# EAGLE schematic silense_analog_question (EAGLE 9.4.2)

## Sheet 1 of 6
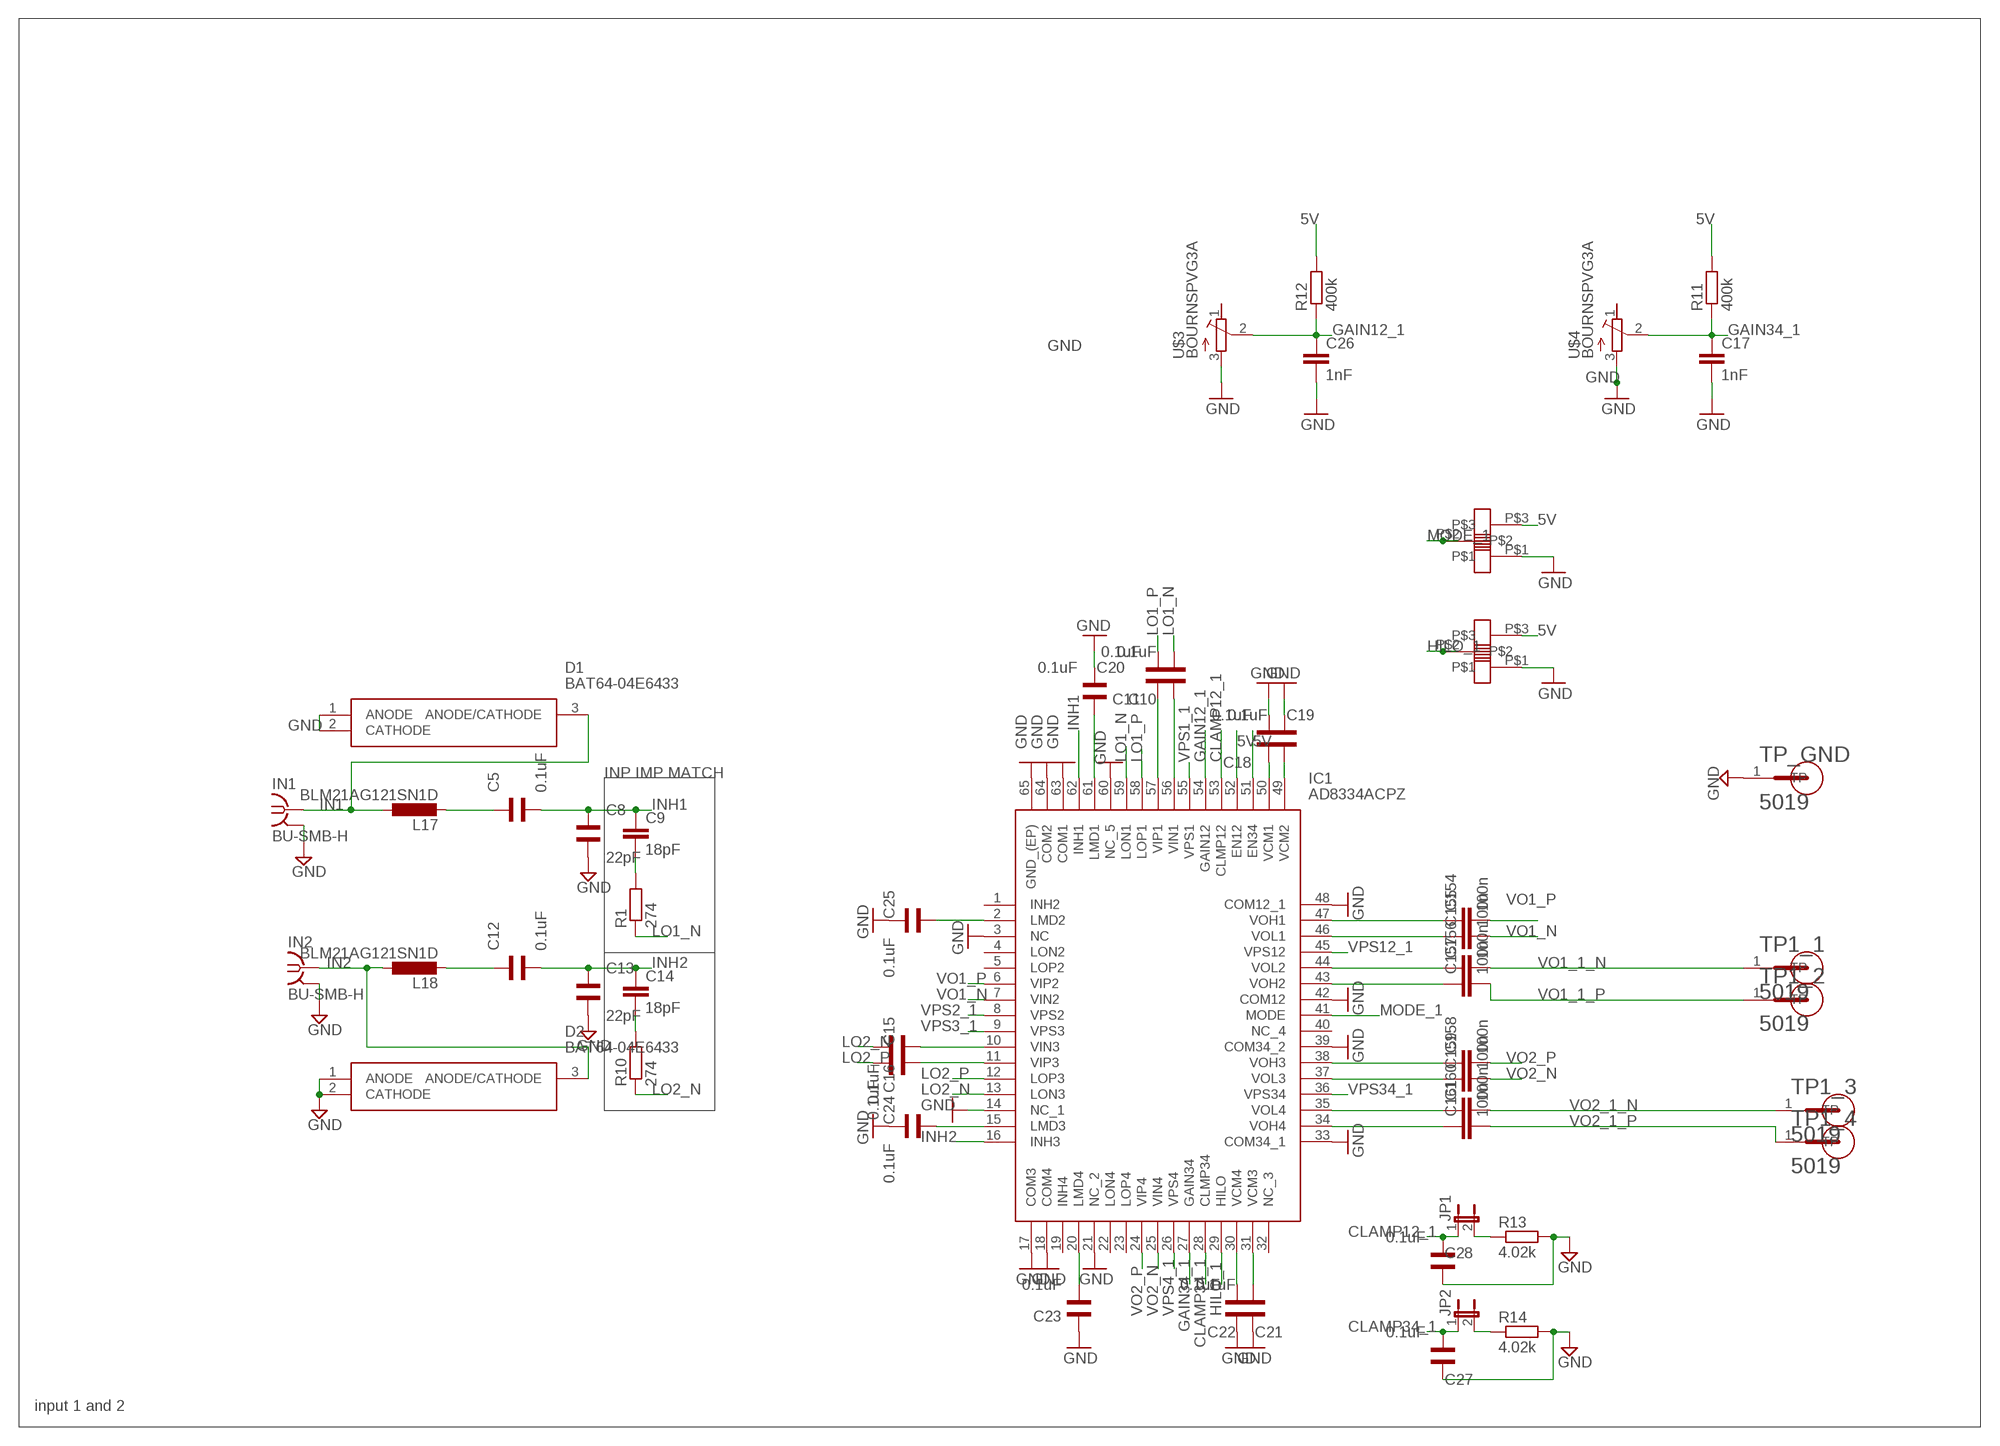
[diagram p0: schematic, sheet 1]

### Parts
C5  0.1uF  WCAP-CSGP_0402_885012205037  [WCAP-CSGP_0402]
C8  22pF  WCAP-CSGP_0402_885012005009  [WCAP-CSGP_0402]
C9  18pF  C-EUC0603  [C0603]
C10  0.1uF  WCAP-CSGP_0402_885012205037  [WCAP-CSGP_0402]
C11  0.1uF  WCAP-CSGP_0402_885012205037  [WCAP-CSGP_0402]
C12  0.1uF  WCAP-CSGP_0402_885012205037  [WCAP-CSGP_0402]
C13  22pF  WCAP-CSGP_0402_885012005009  [WCAP-CSGP_0402]
C14  18pF  C-EUC0603  [C0603]
C15  0.1uF  WCAP-CSGP_0402_885012205037  [WCAP-CSGP_0402]
C16  0.1uF  WCAP-CSGP_0402_885012205037  [WCAP-CSGP_0402]
C17  1nF  C-EUC0402  [C0402]
C18  0.1uF  WCAP-CSGP_0402_885012205037  [WCAP-CSGP_0402]
C19  0.1uF  WCAP-CSGP_0402_885012205037  [WCAP-CSGP_0402]
C20  0.1uF  WCAP-CSGP_0402_885012205037  [WCAP-CSGP_0402]
C21  0.1uF  WCAP-CSGP_0402_885012205037  [WCAP-CSGP_0402]
C22  0.1uF  WCAP-CSGP_0402_885012205037  [WCAP-CSGP_0402]
C23  0.1uF  WCAP-CSGP_0402_885012205037  [WCAP-CSGP_0402]
C24  0.1uF  WCAP-CSGP_0402_885012205037  [WCAP-CSGP_0402]
C25  0.1uF  WCAP-CSGP_0402_885012205037  [WCAP-CSGP_0402]
C26  1nF  C-EUC0402  [C0402]
C27  0.1uF  WCAP-CSGP_0402_885012205037  [WCAP-CSGP_0402]
C28  0.1uF  WCAP-CSGP_0402_885012205037  [WCAP-CSGP_0402]
C154  100n  C-EUC0805  [C0805]
C155  100n  C-EUC0805  [C0805]
C156  100n  C-EUC0805  [C0805]
C157  100n  C-EUC0805  [C0805]
C158  100n  C-EUC0805  [C0805]
C159  100n  C-EUC0805  [C0805]
C160  100n  C-EUC0805  [C0805]
C161  100n  C-EUC0805  [C0805]
D1  BAT64-04E6433  [SOT95P260X110-3N]
D2  BAT64-04E6433  [SOT95P260X110-3N]
IC1  AD8334ACPZ  [QFN50P900X900X100-65N]
IN1  BU-SMB-H  [BU-SMB-H]
IN2  BU-SMB-H  [BU-SMB-H]
JP1  JP1E  [JP1]
JP2  JP1E  [JP1]
L17  BLM21AG121SN1D  L-EUL2012C  [L2012C]
L18  BLM21AG121SN1D  L-EUL2012C  [L2012C]
R1  274  R-EU_R0603  [R0603]
R10  274  R-EU_R0603  [R0603]
R11  400k  R-EU_R0603  [R0603]
R12  400k  R-EU_R0603  [R0603]
R13  4.02k  R-EU_R0805  [R0805]
R14  4.02k  R-EU_R0805  [R0805]
SLIDESWITCH1  CL-SB-12A-01  [CL-SB-12A-01]
SLIDESWITCH2  CL-SB-12A-01  [CL-SB-12A-01]
TP1_1  5019  [TP380X203]
TP1_2  5019  [TP380X203]
TP1_3  5019  [TP380X203]
TP1_4  5019  [TP380X203]
TP_GND  5019  [TP380X203]
U$3  BOURNSPVG3A  [PVG3G]
U$4  BOURNSPVG3A  [PVG3G]

### Nets
5V [power]: IC1.51(EN34) IC1.52(EN12) R11.2 R12.2 SLIDESWITCH1.P$3 SLIDESWITCH2.P$3 ; also sheet 2,3,4,6
CLAMP12_1: C28.1 IC1.53(CLMP12) JP1.1
CLAMP34_1: C27.1 IC1.28(CLMP34) JP2.1
GAIN12_1: C26.1 IC1.54(GAIN12) R12.1 U$3.2
GAIN34_1: C17.1 IC1.27(GAIN34) R11.1 U$4.2
GND [power]: C8.1 C13.1 C17.2 C18.1 C19.1 C20.1 C21.2 C22.2 C23.2 C24.1 C25.1 C26.2 C27.2 C28.2 D1.1(ANODE) D1.2(CATHODE) D2.1(ANODE) D2.2(CATHODE) IC1.3(NC) IC1.14(NC_1) IC1.17(COM3) IC1.18(COM4) IC1.21(NC_2) IC1.33(COM34_1) IC1.39(COM34_2) IC1.42(COM12) IC1.48(COM12_1) IC1.60(NC_5) IC1.63(COM1) IC1.64(COM2) IC1.65(GND_(EP)) IN1.2 IN1.3 IN1.4 IN1.5 IN2.2 IN2.3 IN2.4 IN2.5 R13.2 R14.2 SLIDESWITCH1.P$1 SLIDESWITCH2.P$1 TP_GND.1(TP) U$3.3 U$4.3 ; also sheet 2,3,4,5,6
HILO_1: IC1.29(HILO) SLIDESWITCH2.P$2
IN1: D1.3(ANODE/CATHODE) IN1.1 L17.1
IN2: D2.3(ANODE/CATHODE) IN2.1 L18.1
INH1: C5.1 C8.2 C9.1 IC1.62(INH1)
INH2: C12.1 C13.2 C14.1 IC1.16(INH3)
LO1_N [differential]: C10.1 IC1.59(LON1) R1.1
LO1_P [differential]: C11.1 IC1.58(LOP1)
LO2_N [differential]: C15.1 IC1.13(LON3) R10.1
LO2_P [differential]: C16.1 IC1.12(LOP3)
MODE_1: IC1.41(MODE) SLIDESWITCH1.P$2
N$1: C5.2 L17.2
N$2: C9.2 R1.2
N$4_N: C10.2 IC1.56(VIN1)
N$4_P [differential]: C11.2 IC1.57(VIP1)
N$5: C154.1 IC1.47(VOH1)
N$6: C155.1 IC1.46(VOL1)
N$7: C156.1 IC1.44(VOL2)
N$8: C157.1 IC1.43(VOH2)
N$9: C158.1 IC1.38(VOH3)
N$10: C159.1 IC1.37(VOL3)
N$11: C160.1 IC1.35(VOL4)
N$12: C161.1 IC1.34(VOH4)
N$13: C12.2 L18.2
N$14: C14.2 R10.2
N$15_N: C15.2 IC1.10(VIN3)
N$15_P [differential]: C16.2 IC1.11(VIP3)
N$17: C18.2 IC1.50(VCM1)
N$18: C19.2 IC1.49(VCM2)
N$19: C20.2 IC1.61(LMD1)
N$20: C22.1 IC1.30(VCM4)
N$21: C21.1 IC1.31(VCM3)
N$22: C25.2 IC1.2(LMD2)
N$25: C24.2 IC1.15(LMD3)
N$26: C23.1 IC1.20(LMD4)
N$27: JP1.2 R13.1
N$28: JP2.2 R14.1
VO1_1_N [differential]: C156.2 TP1_1.1(TP) ; also sheet 4
VO1_1_P [differential]: C157.2 TP1_2.1(TP) ; also sheet 4
VO1_N: C155.2 IC1.7(VIN2)
VO1_P [differential]: C154.2 IC1.6(VIP2)
VO2_1_N [differential]: C160.2 TP1_3.1(TP) ; also sheet 4
VO2_1_P [differential]: C161.2 TP1_4.1(TP) ; also sheet 4
VO2_N: C159.2 IC1.25(VIN4)
VO2_P [differential]: C158.2 IC1.24(VIP4)
VPS1_1: IC1.55(VPS1) ; also sheet 2
VPS2_1: IC1.8(VPS2) ; also sheet 2
VPS3_1: IC1.9(VPS3) ; also sheet 2
VPS4_1: IC1.26(VPS4) ; also sheet 2
VPS12_1: IC1.45(VPS12) ; also sheet 2
VPS34_1: IC1.36(VPS34) ; also sheet 2
Unconnected: IC1.1(INH2) IC1.4(LON2) IC1.5(LOP2) IC1.19(INH4) IC1.22(LON4) IC1.23(LOP4) IC1.32(NC_3) IC1.40(NC_4) U$3.1 U$4.1

### Notes on the sheet
- INP IMP MATCH
- input 1 and 2

## Sheet 2 of 6
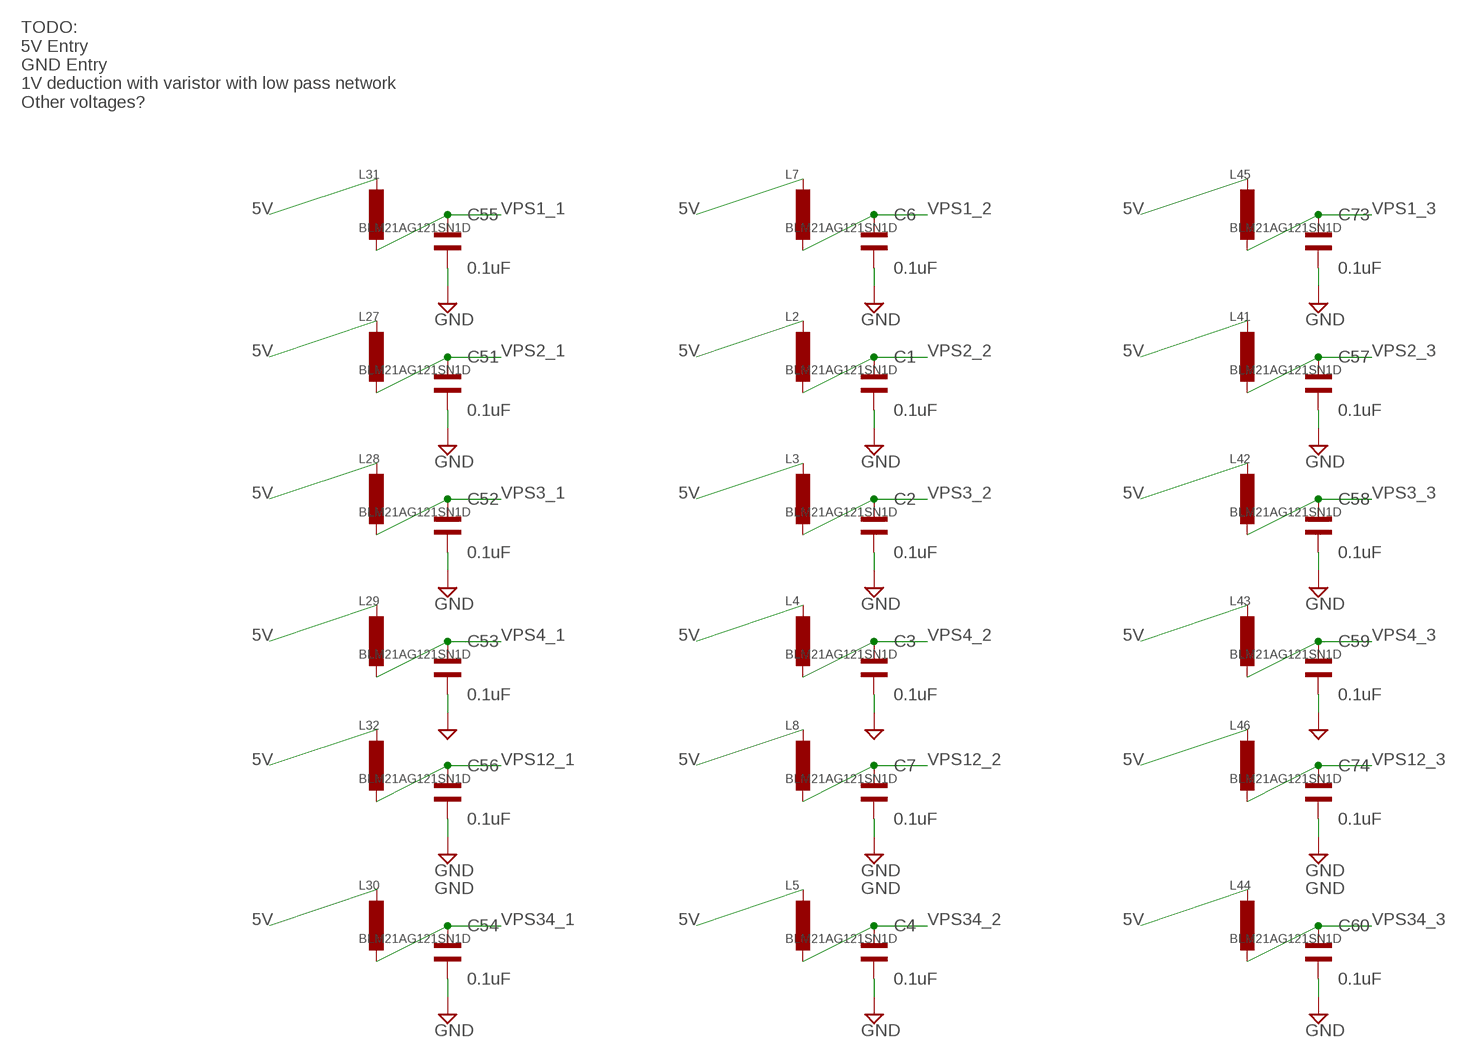
[diagram p1: schematic, sheet 2]

### Parts
C1  0.1uF  WCAP-CSGP_0402_885012205037  [WCAP-CSGP_0402]
C2  0.1uF  WCAP-CSGP_0402_885012205037  [WCAP-CSGP_0402]
C3  0.1uF  WCAP-CSGP_0402_885012205037  [WCAP-CSGP_0402]
C4  0.1uF  WCAP-CSGP_0402_885012205037  [WCAP-CSGP_0402]
C6  0.1uF  WCAP-CSGP_0402_885012205037  [WCAP-CSGP_0402]
C7  0.1uF  WCAP-CSGP_0402_885012205037  [WCAP-CSGP_0402]
C51  0.1uF  WCAP-CSGP_0402_885012205037  [WCAP-CSGP_0402]
C52  0.1uF  WCAP-CSGP_0402_885012205037  [WCAP-CSGP_0402]
C53  0.1uF  WCAP-CSGP_0402_885012205037  [WCAP-CSGP_0402]
C54  0.1uF  WCAP-CSGP_0402_885012205037  [WCAP-CSGP_0402]
C55  0.1uF  WCAP-CSGP_0402_885012205037  [WCAP-CSGP_0402]
C56  0.1uF  WCAP-CSGP_0402_885012205037  [WCAP-CSGP_0402]
C57  0.1uF  WCAP-CSGP_0402_885012205037  [WCAP-CSGP_0402]
C58  0.1uF  WCAP-CSGP_0402_885012205037  [WCAP-CSGP_0402]
C59  0.1uF  WCAP-CSGP_0402_885012205037  [WCAP-CSGP_0402]
C60  0.1uF  WCAP-CSGP_0402_885012205037  [WCAP-CSGP_0402]
C73  0.1uF  WCAP-CSGP_0402_885012205037  [WCAP-CSGP_0402]
C74  0.1uF  WCAP-CSGP_0402_885012205037  [WCAP-CSGP_0402]
L2  BLM21AG121SN1D  L-EUL2012C  [L2012C]
L3  BLM21AG121SN1D  L-EUL2012C  [L2012C]
L4  BLM21AG121SN1D  L-EUL2012C  [L2012C]
L5  BLM21AG121SN1D  L-EUL2012C  [L2012C]
L7  BLM21AG121SN1D  L-EUL2012C  [L2012C]
L8  BLM21AG121SN1D  L-EUL2012C  [L2012C]
L27  BLM21AG121SN1D  L-EUL2012C  [L2012C]
L28  BLM21AG121SN1D  L-EUL2012C  [L2012C]
L29  BLM21AG121SN1D  L-EUL2012C  [L2012C]
L30  BLM21AG121SN1D  L-EUL2012C  [L2012C]
L31  BLM21AG121SN1D  L-EUL2012C  [L2012C]
L32  BLM21AG121SN1D  L-EUL2012C  [L2012C]
L41  BLM21AG121SN1D  L-EUL2012C  [L2012C]
L42  BLM21AG121SN1D  L-EUL2012C  [L2012C]
L43  BLM21AG121SN1D  L-EUL2012C  [L2012C]
L44  BLM21AG121SN1D  L-EUL2012C  [L2012C]
L45  BLM21AG121SN1D  L-EUL2012C  [L2012C]
L46  BLM21AG121SN1D  L-EUL2012C  [L2012C]

### Nets
5V [power]: L2.1 L3.1 L4.1 L5.1 L7.1 L8.1 L27.1 L28.1 L29.1 L30.1 L31.1 L32.1 L41.1 L42.1 L43.1 L44.1 L45.1 L46.1 ; also sheet 1,3,4,6
GND [power]: C1.1 C2.1 C3.1 C4.1 C6.1 C7.1 C51.1 C52.1 C53.1 C54.1 C55.1 C56.1 C57.1 C58.1 C59.1 C60.1 C73.1 C74.1 ; also sheet 1,3,4,5,6
VPS1_1: C55.2 L31.2 ; also sheet 1
VPS1_2: C6.2 L7.2 ; also sheet 3
VPS1_3: C73.2 L45.2 ; also sheet 4
VPS2_1: C51.2 L27.2 ; also sheet 1
VPS2_2: C1.2 L2.2 ; also sheet 3
VPS2_3: C57.2 L41.2 ; also sheet 4
VPS3_1: C52.2 L28.2 ; also sheet 1
VPS3_2: C2.2 L3.2 ; also sheet 3
VPS3_3: C58.2 L42.2 ; also sheet 4
VPS4_1: C53.2 L29.2 ; also sheet 1
VPS4_2: C3.2 L4.2 ; also sheet 3
VPS4_3: C59.2 L43.2 ; also sheet 4
VPS12_1: C56.2 L32.2 ; also sheet 1
VPS12_2: C7.2 L8.2 ; also sheet 3
VPS12_3: C74.2 L46.2 ; also sheet 4
VPS34_1: C54.2 L30.2 ; also sheet 1
VPS34_2: C4.2 L5.2 ; also sheet 3
VPS34_3: C60.2 L44.2 ; also sheet 4

### Notes on the sheet
- TODO:
  5V Entry
  GND Entry
  1V deduction with varistor with low pass network
  Other voltages?

## Sheet 3 of 6
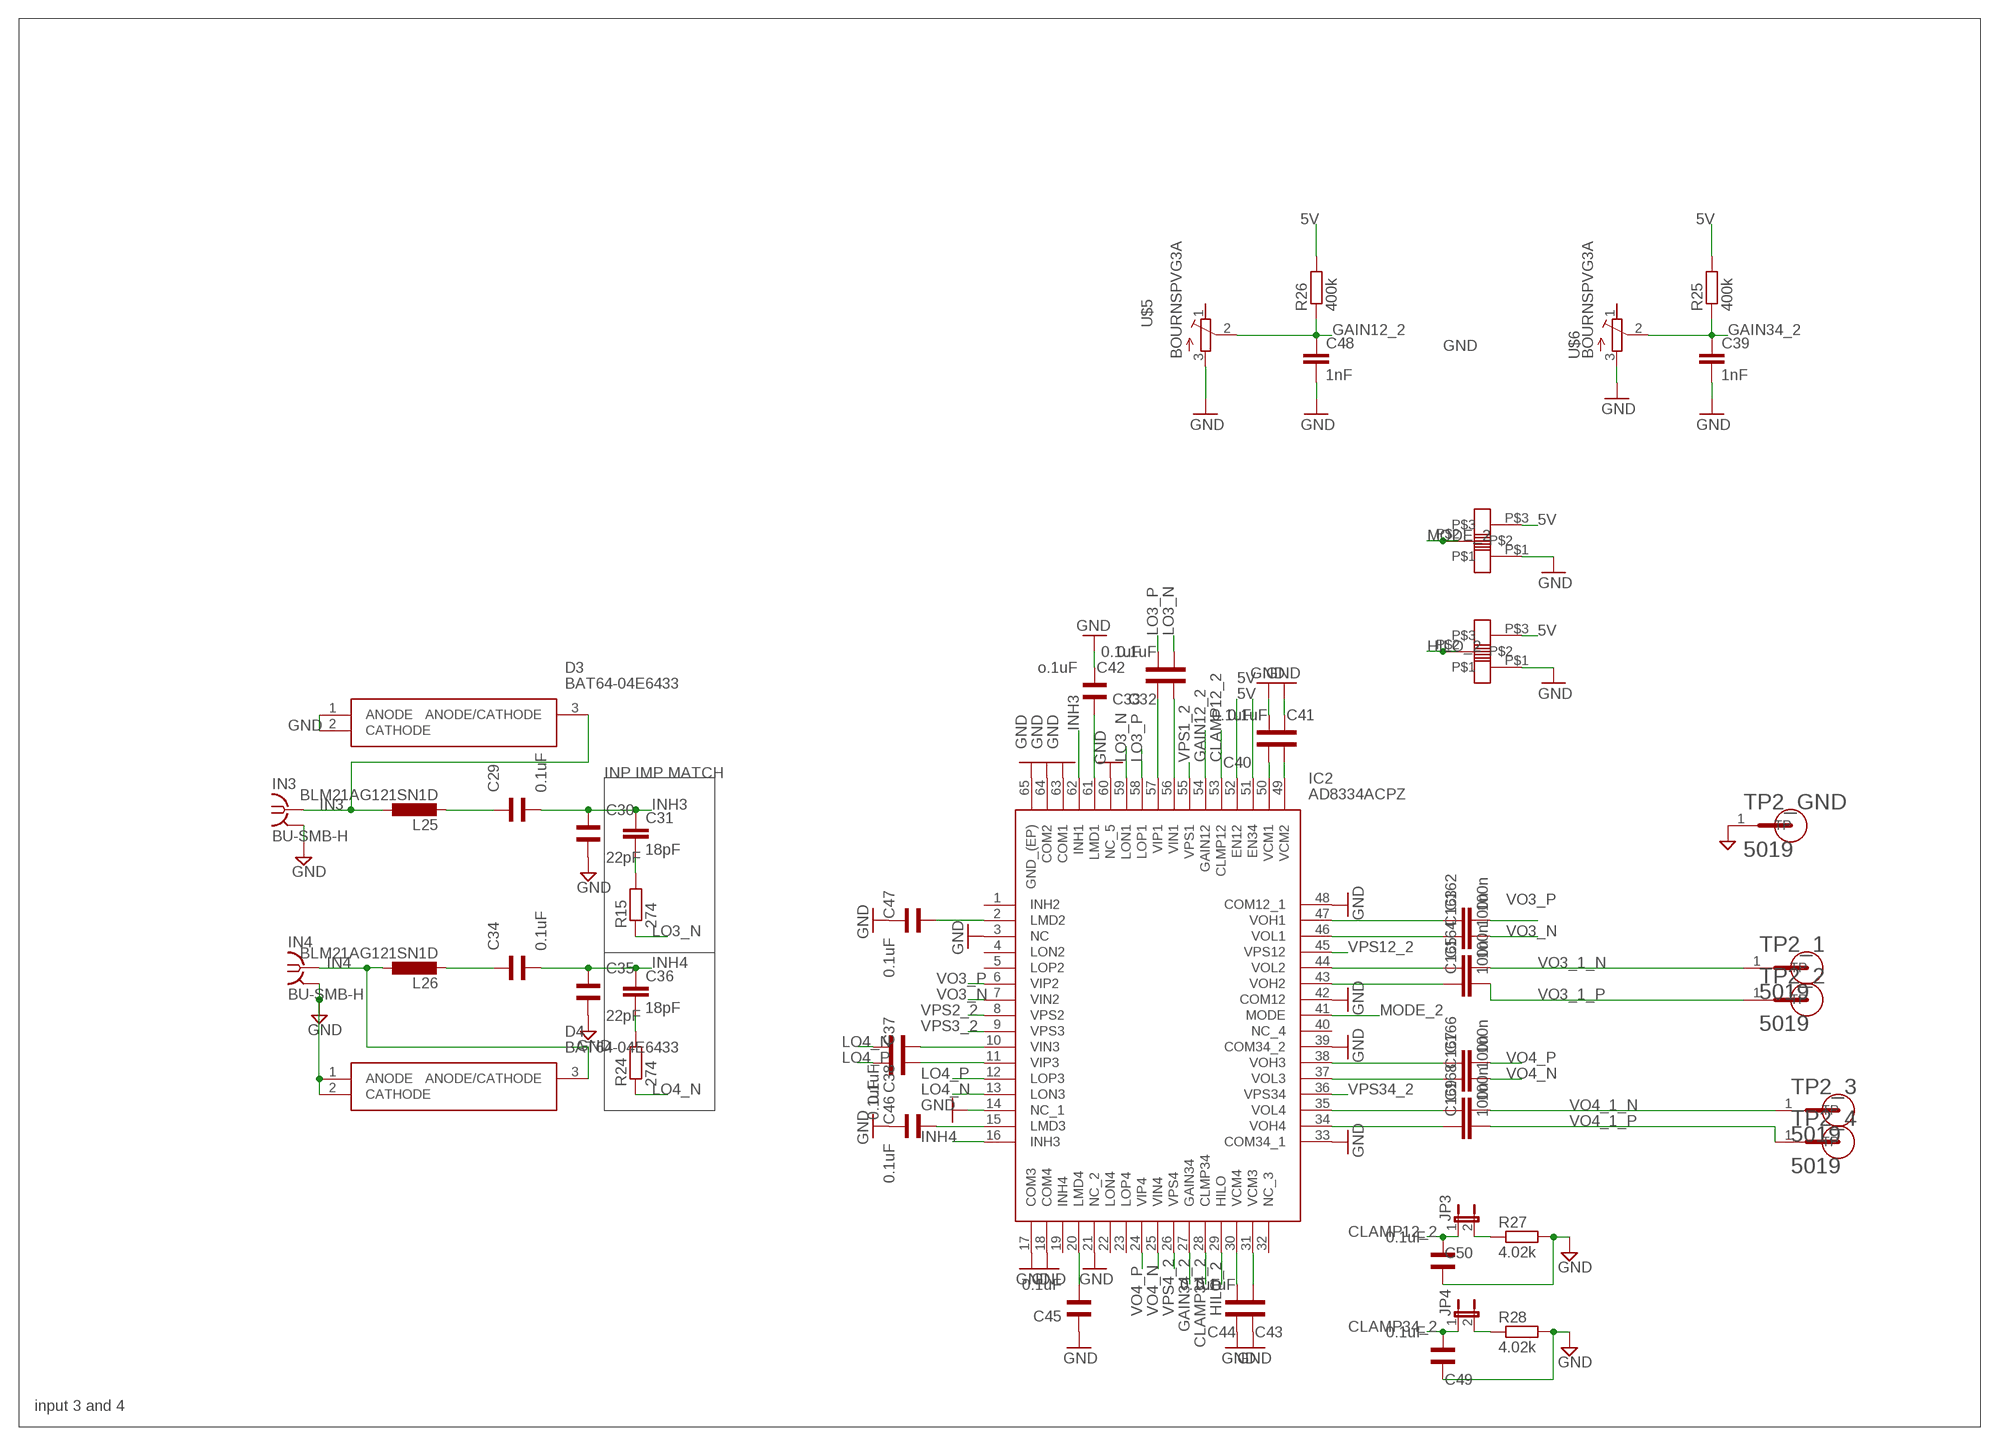
[diagram p2: schematic, sheet 3]

### Parts
C29  0.1uF  WCAP-CSGP_0402_885012205037  [WCAP-CSGP_0402]
C30  22pF  WCAP-CSGP_0402_885012005009  [WCAP-CSGP_0402]
C31  18pF  C-EUC0603  [C0603]
C32  0.1uF  WCAP-CSGP_0402_885012205037  [WCAP-CSGP_0402]
C33  0.1uF  WCAP-CSGP_0402_885012205037  [WCAP-CSGP_0402]
C34  0.1uF  WCAP-CSGP_0402_885012205037  [WCAP-CSGP_0402]
C35  22pF  WCAP-CSGP_0402_885012005009  [WCAP-CSGP_0402]
C36  18pF  C-EUC0603  [C0603]
C37  0.1uF  WCAP-CSGP_0402_885012205037  [WCAP-CSGP_0402]
C38  0.1uF  WCAP-CSGP_0402_885012205037  [WCAP-CSGP_0402]
C39  1nF  C-EUC0402  [C0402]
C40  0.1uF  WCAP-CSGP_0402_885012205037  [WCAP-CSGP_0402]
C41  0.1uF  WCAP-CSGP_0402_885012205037  [WCAP-CSGP_0402]
C42  o.1uF  WCAP-CSGP_0402_885012205037  [WCAP-CSGP_0402]
C43  0.1uF  WCAP-CSGP_0402_885012205037  [WCAP-CSGP_0402]
C44  0.1uF  WCAP-CSGP_0402_885012205037  [WCAP-CSGP_0402]
C45  0.1uF  WCAP-CSGP_0402_885012205037  [WCAP-CSGP_0402]
C46  0.1uF  WCAP-CSGP_0402_885012205037  [WCAP-CSGP_0402]
C47  0.1uF  WCAP-CSGP_0402_885012205037  [WCAP-CSGP_0402]
C48  1nF  C-EUC0402  [C0402]
C49  0.1uF  WCAP-CSGP_0402_885012205037  [WCAP-CSGP_0402]
C50  0.1uF  WCAP-CSGP_0402_885012205037  [WCAP-CSGP_0402]
C162  100n  C-EUC0805  [C0805]
C163  100n  C-EUC0805  [C0805]
C164  100n  C-EUC0805  [C0805]
C165  100n  C-EUC0805  [C0805]
C166  100n  C-EUC0805  [C0805]
C167  100n  C-EUC0805  [C0805]
C168  100n  C-EUC0805  [C0805]
C169  100n  C-EUC0805  [C0805]
D3  BAT64-04E6433  [SOT95P260X110-3N]
D4  BAT64-04E6433  [SOT95P260X110-3N]
IC2  AD8334ACPZ  [QFN50P900X900X100-65N]
IN3  BU-SMB-H  [BU-SMB-H]
IN4  BU-SMB-H  [BU-SMB-H]
JP3  JP1E  [JP1]
JP4  JP1E  [JP1]
L25  BLM21AG121SN1D  L-EUL2012C  [L2012C]
L26  BLM21AG121SN1D  L-EUL2012C  [L2012C]
R15  274  R-EU_R0603  [R0603]
R24  274  R-EU_R0603  [R0603]
R25  400k  R-EU_R0603  [R0603]
R26  400k  R-EU_R0603  [R0603]
R27  4.02k  R-EU_R0805  [R0805]
R28  4.02k  R-EU_R0805  [R0805]
SLIDESWITCH3  CL-SB-12A-01  [CL-SB-12A-01]
SLIDESWITCH4  CL-SB-12A-01  [CL-SB-12A-01]
TP2_1  5019  [TP380X203]
TP2_2  5019  [TP380X203]
TP2_3  5019  [TP380X203]
TP2_4  5019  [TP380X203]
TP2_GND  5019  [TP380X203]
U$5  BOURNSPVG3A  [PVG3G]
U$6  BOURNSPVG3A  [PVG3G]

### Nets
5V [power]: IC2.51(EN34) IC2.52(EN12) R25.2 R26.2 SLIDESWITCH3.P$3 SLIDESWITCH4.P$3 ; also sheet 1,2,4,6
CLAMP12_2: C50.1 IC2.53(CLMP12) JP3.1
CLAMP34_2: C49.1 IC2.28(CLMP34) JP4.1
GAIN12_2: C48.1 IC2.54(GAIN12) R26.1 U$5.2
GAIN34_2: C39.1 IC2.27(GAIN34) R25.1 U$6.2
GND [power]: C30.1 C35.1 C39.2 C40.1 C41.1 C42.1 C43.2 C44.2 C45.2 C46.1 C47.1 C48.2 C49.2 C50.2 D3.1(ANODE) D3.2(CATHODE) D4.1(ANODE) D4.2(CATHODE) IC2.3(NC) IC2.14(NC_1) IC2.17(COM3) IC2.18(COM4) IC2.21(NC_2) IC2.33(COM34_1) IC2.39(COM34_2) IC2.42(COM12) IC2.48(COM12_1) IC2.60(NC_5) IC2.63(COM1) IC2.64(COM2) IC2.65(GND_(EP)) IN3.2 IN3.3 IN3.4 IN3.5 IN4.2 IN4.3 IN4.4 IN4.5 R27.2 R28.2 SLIDESWITCH3.P$1 SLIDESWITCH4.P$1 TP2_GND.1(TP) U$5.3 U$6.3 ; also sheet 1,2,4,5,6
HILO_2: IC2.29(HILO) SLIDESWITCH4.P$2
IN3: D3.3(ANODE/CATHODE) IN3.1 L25.1
IN4: D4.3(ANODE/CATHODE) IN4.1 L26.1
INH3: C29.1 C30.2 C31.1 IC2.62(INH1)
INH4: C34.1 C35.2 C36.1 IC2.16(INH3)
LO3_N [differential]: C32.1 IC2.59(LON1) R15.1
LO3_P [differential]: C33.1 IC2.58(LOP1)
LO4_N [differential]: C37.1 IC2.13(LON3) R24.1
LO4_P [differential]: C38.1 IC2.12(LOP3)
MODE_2: IC2.41(MODE) SLIDESWITCH3.P$2
N$29: C29.2 L25.2
N$30: C31.2 R15.2
N$32_N [differential]: C32.2 IC2.56(VIN1)
N$32_P [differential]: C33.2 IC2.57(VIP1)
N$41: C34.2 L26.2
N$42: C36.2 R24.2
N$43: C37.2 IC2.10(VIN3)
N$44: C38.2 IC2.11(VIP3)
N$45: C40.2 IC2.50(VCM1)
N$46: C41.2 IC2.49(VCM2)
N$47: C162.1 IC2.47(VOH1)
N$48: C163.1 IC2.46(VOL1)
N$49: C42.2 IC2.61(LMD1)
N$50: C44.1 IC2.30(VCM4)
N$51: C43.1 IC2.31(VCM3)
N$52: C47.2 IC2.2(LMD2)
N$53: C46.2 IC2.15(LMD3)
N$54: C45.1 IC2.20(LMD4)
N$55: JP3.2 R27.1
N$56: JP4.2 R28.1
N$71: C164.1 IC2.44(VOL2)
N$72: C165.1 IC2.43(VOH2)
N$84: C166.1 IC2.38(VOH3)
N$85: C167.1 IC2.37(VOL3)
N$86: C168.1 IC2.35(VOL4)
N$87: C169.1 IC2.34(VOH4)
VO3_1_N [differential]: C164.2 TP2_1.1(TP) ; also sheet 4
VO3_1_P [differential]: C165.2 TP2_2.1(TP) ; also sheet 4
VO3_N [differential]: C163.2 IC2.7(VIN2)
VO3_P [differential]: C162.2 IC2.6(VIP2)
VO4_1_N [differential]: C168.2 TP2_3.1(TP) ; also sheet 4
VO4_1_P [differential]: C169.2 TP2_4.1(TP) ; also sheet 4
VO4_N [differential]: C167.2 IC2.25(VIN4)
VO4_P [differential]: C166.2 IC2.24(VIP4)
VPS1_2: IC2.55(VPS1) ; also sheet 2
VPS2_2: IC2.8(VPS2) ; also sheet 2
VPS3_2: IC2.9(VPS3) ; also sheet 2
VPS4_2: IC2.26(VPS4) ; also sheet 2
VPS12_2: IC2.45(VPS12) ; also sheet 2
VPS34_2: IC2.36(VPS34) ; also sheet 2
Unconnected: IC2.1(INH2) IC2.4(LON2) IC2.5(LOP2) IC2.19(INH4) IC2.22(LON4) IC2.23(LOP4) IC2.32(NC_3) IC2.40(NC_4) U$5.1 U$6.1

### Notes on the sheet
- INP IMP MATCH
- input 3 and 4

## Sheet 4 of 6
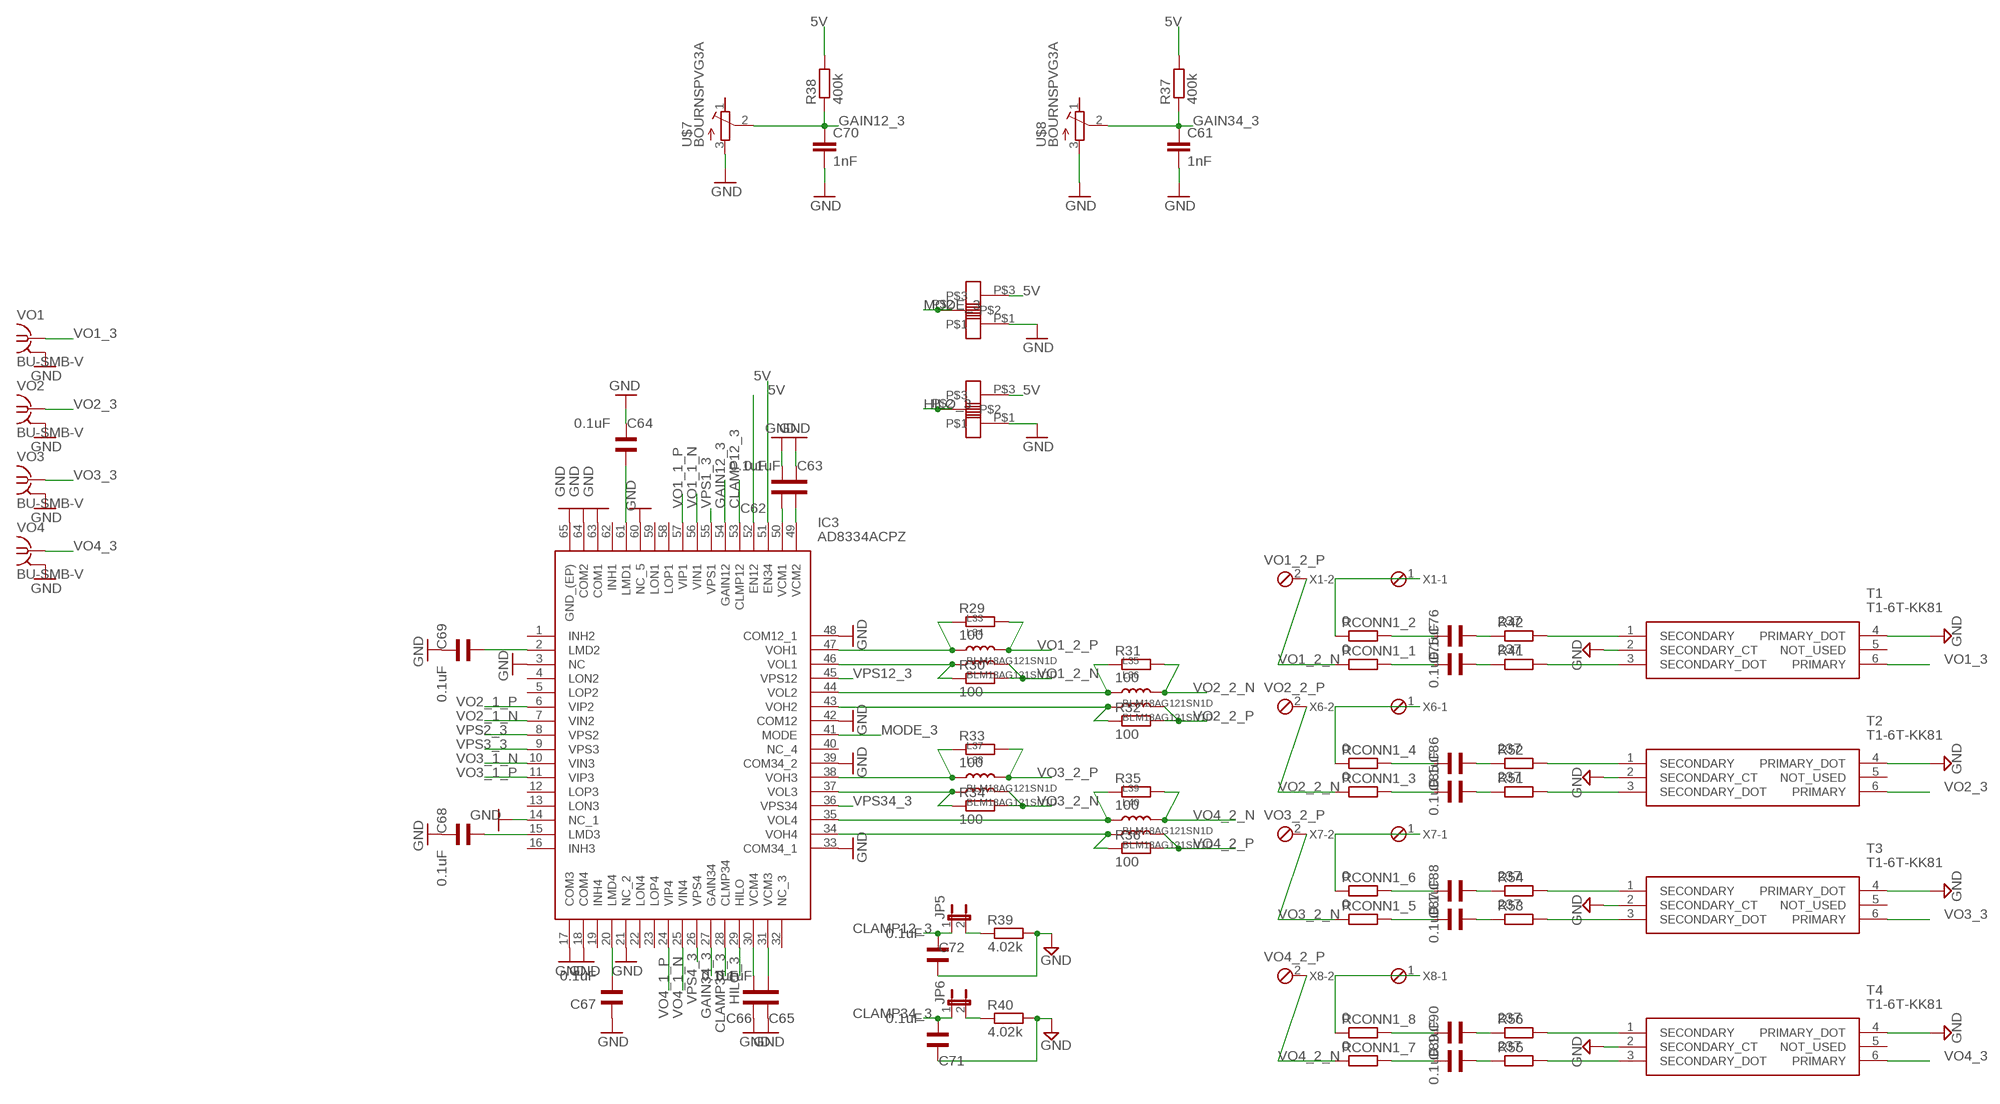
[diagram p3: schematic, sheet 4]

### Parts
C61  1nF  C-EUC0402  [C0402]
C62  0.1uF  WCAP-CSGP_0402_885012205037  [WCAP-CSGP_0402]
C63  0.1uF  WCAP-CSGP_0402_885012205037  [WCAP-CSGP_0402]
C64  0.1uF  WCAP-CSGP_0402_885012205037  [WCAP-CSGP_0402]
C65  0.1uF  WCAP-CSGP_0402_885012205037  [WCAP-CSGP_0402]
C66  0.1uF  WCAP-CSGP_0402_885012205037  [WCAP-CSGP_0402]
C67  0.1uF  WCAP-CSGP_0402_885012205037  [WCAP-CSGP_0402]
C68  0.1uF  WCAP-CSGP_0402_885012205037  [WCAP-CSGP_0402]
C69  0.1uF  WCAP-CSGP_0402_885012205037  [WCAP-CSGP_0402]
C70  1nF  C-EUC0402  [C0402]
C71  0.1uF  WCAP-CSGP_0402_885012205037  [WCAP-CSGP_0402]
C72  0.1uF  WCAP-CSGP_0402_885012205037  [WCAP-CSGP_0402]
C75  0.1uF  WCAP-CSGP_0402_885012205037  [WCAP-CSGP_0402]
C76  0.1uF  WCAP-CSGP_0402_885012205037  [WCAP-CSGP_0402]
C85  0.1uF  WCAP-CSGP_0402_885012205037  [WCAP-CSGP_0402]
C86  0.1uF  WCAP-CSGP_0402_885012205037  [WCAP-CSGP_0402]
C87  0.1uF  WCAP-CSGP_0402_885012205037  [WCAP-CSGP_0402]
C88  0.1uF  WCAP-CSGP_0402_885012205037  [WCAP-CSGP_0402]
C89  0.1uF  WCAP-CSGP_0402_885012205037  [WCAP-CSGP_0402]
C90  0.1uF  WCAP-CSGP_0402_885012205037  [WCAP-CSGP_0402]
IC3  AD8334ACPZ  [QFN50P900X900X100-65N]
JP5  JP1E  [JP1]
JP6  JP1E  [JP1]
L33  BLM18AG121SN1D  SMD-FERRITE-CHIP-120-OHM-500MA(0603)  [L0603]
L34  BLM18AG121SN1D  SMD-FERRITE-CHIP-120-OHM-500MA(0603)  [L0603]
L35  BLM18AG121SN1D  SMD-FERRITE-CHIP-120-OHM-500MA(0603)  [L0603]
L36  BLM18AG121SN1D  SMD-FERRITE-CHIP-120-OHM-500MA(0603)  [L0603]
L37  BLM18AG121SN1D  SMD-FERRITE-CHIP-120-OHM-500MA(0603)  [L0603]
L38  BLM18AG121SN1D  SMD-FERRITE-CHIP-120-OHM-500MA(0603)  [L0603]
L39  BLM18AG121SN1D  SMD-FERRITE-CHIP-120-OHM-500MA(0603)  [L0603]
L40  BLM18AG121SN1D  SMD-FERRITE-CHIP-120-OHM-500MA(0603)  [L0603]
R29  100  R-EU_R0402  [R0402]
R30  100  R-EU_R0402  [R0402]
R31  100  R-EU_R0402  [R0402]
R32  100  R-EU_R0402  [R0402]
R33  100  R-EU_R0402  [R0402]
R34  100  R-EU_R0402  [R0402]
R35  100  R-EU_R0402  [R0402]
R36  100  R-EU_R0402  [R0402]
R37  400k  R-EU_R0603  [R0603]
R38  400k  R-EU_R0603  [R0603]
R39  4.02k  R-EU_R0805  [R0805]
R40  4.02k  R-EU_R0805  [R0805]
R41  237  R-EU_R0603  [R0603]
R42  237  R-EU_R0603  [R0603]
R51  237  R-EU_R0603  [R0603]
R52  237  R-EU_R0603  [R0603]
R53  237  R-EU_R0603  [R0603]
R54  237  R-EU_R0603  [R0603]
R55  237  R-EU_R0603  [R0603]
R56  237  R-EU_R0603  [R0603]
RCONN1_1  0  R-EU_R0402  [R0402]
RCONN1_2  0  R-EU_R0402  [R0402]
RCONN1_3  0  R-EU_R0402  [R0402]
RCONN1_4  0  R-EU_R0402  [R0402]
RCONN1_5  0  R-EU_R0402  [R0402]
RCONN1_6  0  R-EU_R0402  [R0402]
RCONN1_7  0  R-EU_R0402  [R0402]
RCONN1_8  0  R-EU_R0402  [R0402]
SLIDESWITCH5  CL-SB-12A-01  [CL-SB-12A-01]
SLIDESWITCH6  CL-SB-12A-01  [CL-SB-12A-01]
T1  T1-6T-KK81  [T16TKK81]
T2  T1-6T-KK81  [T16TKK81]
T3  T1-6T-KK81  [T16TKK81]
T4  T1-6T-KK81  [T16TKK81]
U$7  BOURNSPVG3A  [PVG3G]
U$8  BOURNSPVG3A  [PVG3G]
VO1  BU-SMB-V  [BU-SMB-V]
VO2  BU-SMB-V  [BU-SMB-V]
VO3  BU-SMB-V  [BU-SMB-V]
VO4  BU-SMB-V  [BU-SMB-V]
X1  MPT2  [2POL254]
X6  MPT2  [2POL254]
X7  MPT2  [2POL254]
X8  MPT2  [2POL254]

### Nets
5V [power]: IC3.51(EN34) IC3.52(EN12) R37.2 R38.2 SLIDESWITCH5.P$3 SLIDESWITCH6.P$3 ; also sheet 1,2,3,6
CLAMP12_3: C72.1 IC3.53(CLMP12) JP5.1
CLAMP34_3: C71.1 IC3.28(CLMP34) JP6.1
GAIN12_3: C70.1 IC3.54(GAIN12) R38.1 U$7.2
GAIN34_3: C61.1 IC3.27(GAIN34) R37.1 U$8.2
GND [power]: C61.2 C62.1 C63.1 C64.1 C65.2 C66.2 C67.2 C68.1 C69.1 C70.2 C71.2 C72.2 IC3.3(NC) IC3.14(NC_1) IC3.17(COM3) IC3.18(COM4) IC3.21(NC_2) IC3.33(COM34_1) IC3.39(COM34_2) IC3.42(COM12) IC3.48(COM12_1) IC3.60(NC_5) IC3.63(COM1) IC3.64(COM2) IC3.65(GND_(EP)) R39.2 R40.2 SLIDESWITCH5.P$1 SLIDESWITCH6.P$1 T1.2(SECONDARY_CT) T1.4(PRIMARY_DOT) T2.2(SECONDARY_CT) T2.4(PRIMARY_DOT) T3.2(SECONDARY_CT) T3.4(PRIMARY_DOT) T4.2(SECONDARY_CT) T4.4(PRIMARY_DOT) U$7.3 U$8.3 VO1.2 VO1.3 VO1.4 VO1.5 VO2.2 VO2.3 VO2.4 VO2.5 VO3.2 VO3.3 VO3.4 VO3.5 VO4.2 VO4.3 VO4.4 VO4.5 ; also sheet 1,2,3,5,6
HILO_3: IC3.29(HILO) SLIDESWITCH6.P$2
MODE_3: IC3.41(MODE) SLIDESWITCH5.P$2
N$58_N [differential]: C75.2 R41.1
N$58_P [differential]: C76.2 R42.1
N$59: IC3.47(VOH1) L33.1 R29.1
N$60: IC3.46(VOL1) L34.1 R30.1
N$61_N [differential]: IC3.44(VOL2) L35.1 R31.1
N$61_P [differential]: IC3.43(VOH2) L36.1 R32.1
N$63_N [differential]: IC3.37(VOL3) L38.1 R34.1
N$63_P [differential]: IC3.38(VOH3) L37.1 R33.1
N$65_N [differential]: IC3.35(VOL4) L39.1 R35.1
N$65_P [differential]: IC3.34(VOH4) L40.1 R36.1
N$67_N [differential]: C75.1 RCONN1_1.2
N$67_P [differential]: C76.1 RCONN1_2.2
N$69: C62.2 IC3.50(VCM1)
N$70: C63.2 IC3.49(VCM2)
N$73: C64.2 IC3.61(LMD1)
N$74: C66.1 IC3.30(VCM4)
N$75: C65.1 IC3.31(VCM3)
N$76: C69.2 IC3.2(LMD2)
N$77: C68.2 IC3.15(LMD3)
N$78: C67.1 IC3.20(LMD4)
N$79: JP5.2 R39.1
N$80: JP6.2 R40.1
N$581_N [differential]: C85.2 R51.1
N$581_P [differential]: C86.2 R52.1
N$582_N [differential]: C87.2 R53.1
N$582_P [differential]: C88.2 R54.1
N$583_N [differential]: C89.2 R55.1
N$583_P [differential]: C90.2 R56.1
N$671_N [differential]: C85.1 RCONN1_3.2
N$671_P [differential]: C86.1 RCONN1_4.2
N$672_N [differential]: C87.1 RCONN1_5.2
N$672_P [differential]: C88.1 RCONN1_6.2
N$673_N [differential]: C89.1 RCONN1_7.2
N$673_P [differential]: C90.1 RCONN1_8.2
V01_2_T_P [differential]: R41.2 T1.3(SECONDARY_DOT)
V02_2_T_P [differential]: R51.2 T2.3(SECONDARY_DOT)
V03_2_T_P [differential]: R53.2 T3.3(SECONDARY_DOT)
V04_2_T_P [differential]: R55.2 T4.3(SECONDARY_DOT)
VO1_1_N [differential]: IC3.56(VIN1) ; also sheet 1
VO1_1_P [differential]: IC3.57(VIP1) ; also sheet 1
VO1_2_N [differential]: L34.2 R30.2 RCONN1_1.1 X1.2
VO1_2_P [differential]: L33.2 R29.2 RCONN1_2.1 X1.1
VO1_2_T_N [differential]: R42.2 T1.1(SECONDARY)
VO1_3: T1.6(PRIMARY) VO1.1 ; also sheet 5
VO2_1_N [differential]: IC3.7(VIN2) ; also sheet 1
VO2_1_P [differential]: IC3.6(VIP2) ; also sheet 1
VO2_2_N [differential]: L35.2 R31.2 RCONN1_3.1 X6.2
VO2_2_P [differential]: L36.2 R32.2 RCONN1_4.1 X6.1
VO2_2_T_N [differential]: R52.2 T2.1(SECONDARY)
VO2_3: T2.6(PRIMARY) VO2.1 ; also sheet 5
VO3_1_N [differential]: IC3.10(VIN3) ; also sheet 3
VO3_1_P [differential]: IC3.11(VIP3) ; also sheet 3
VO3_2_N [differential]: L38.2 R34.2 RCONN1_5.1 X7.2
VO3_2_P [differential]: L37.2 R33.2 RCONN1_6.1 X7.1
VO3_2_T_N [differential]: R54.2 T3.1(SECONDARY)
VO3_3: T3.6(PRIMARY) VO3.1 ; also sheet 5
VO4_1_N [differential]: IC3.25(VIN4) ; also sheet 3
VO4_1_P [differential]: IC3.24(VIP4) ; also sheet 3
VO4_2_N [differential]: L39.2 R35.2 RCONN1_7.1 X8.2
VO4_2_P [differential]: L40.2 R36.2 RCONN1_8.1 X8.1
VO4_2_T_N [differential]: R56.2 T4.1(SECONDARY)
VO4_3: T4.6(PRIMARY) VO4.1 ; also sheet 5
VPS1_3: IC3.55(VPS1) ; also sheet 2
VPS2_3: IC3.8(VPS2) ; also sheet 2
VPS3_3: IC3.9(VPS3) ; also sheet 2
VPS4_3: IC3.26(VPS4) ; also sheet 2
VPS12_3: IC3.45(VPS12) ; also sheet 2
VPS34_3: IC3.36(VPS34) ; also sheet 2
Unconnected: IC3.1(INH2) IC3.4(LON2) IC3.5(LOP2) IC3.12(LOP3) IC3.13(LON3) IC3.16(INH3) IC3.19(INH4) IC3.22(LON4) IC3.23(LOP4) IC3.32(NC_3) IC3.40(NC_4) IC3.58(LOP1) IC3.59(LON1) IC3.62(INH1) T1.5(NOT_USED) T2.5(NOT_USED) T3.5(NOT_USED) T4.5(NOT_USED) U$7.1 U$8.1

## Sheet 5 of 6
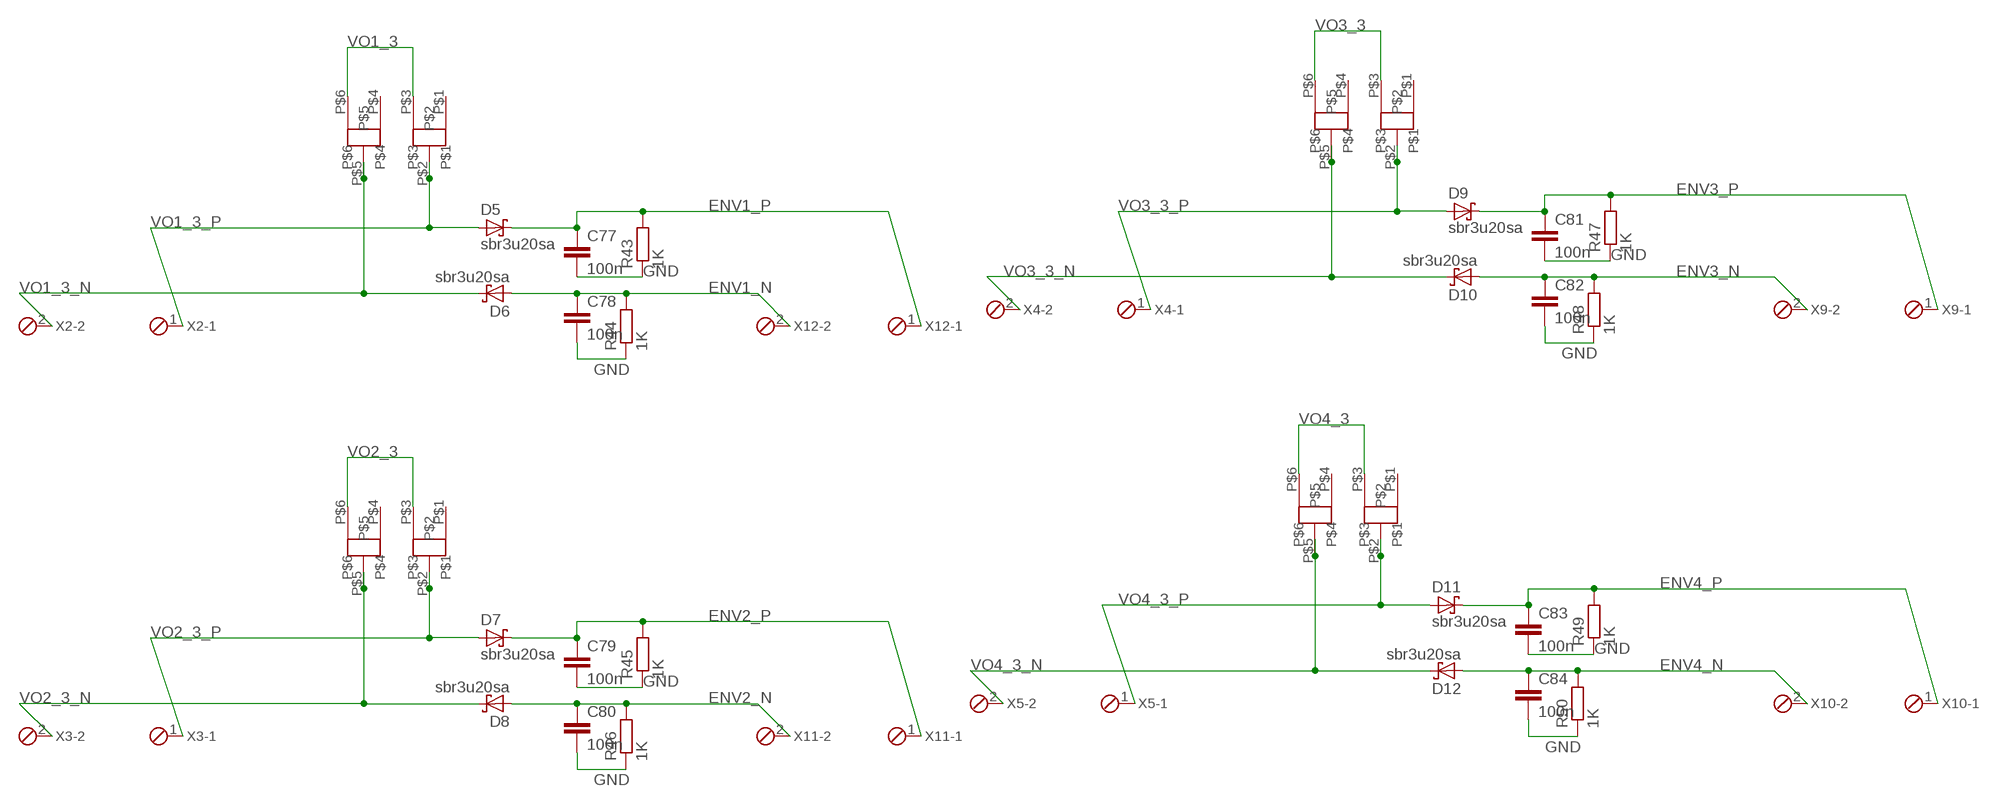
[diagram p4: schematic, sheet 5]

### Parts
C77  100n  C-EU050-025X075  [C050-025X075]
C78  100n  C-EU050-025X075  [C050-025X075]
C79  100n  C-EU050-025X075  [C050-025X075]
C80  100n  C-EU050-025X075  [C050-025X075]
C81  100n  C-EU050-025X075  [C050-025X075]
C82  100n  C-EU050-025X075  [C050-025X075]
C83  100n  C-EU050-025X075  [C050-025X075]
C84  100n  C-EU050-025X075  [C050-025X075]
D5  sbr3u20sa  SBR3U20SASBR3U20SA  [SMA]
D6  sbr3u20sa  SBR3U20SASBR3U20SA  [SMA]
D7  sbr3u20sa  SBR3U20SASBR3U20SA  [SMA]
D8  sbr3u20sa  SBR3U20SASBR3U20SA  [SMA]
D9  sbr3u20sa  SBR3U20SASBR3U20SA  [SMA]
D10  sbr3u20sa  SBR3U20SASBR3U20SA  [SMA]
D11  sbr3u20sa  SBR3U20SASBR3U20SA  [SMA]
D12  sbr3u20sa  SBR3U20SASBR3U20SA  [SMA]
R43  1K  R-EU_0207/7  [0207/7]
R44  1K  R-EU_0207/7  [0207/7]
R45  1K  R-EU_0207/7  [0207/7]
R46  1K  R-EU_0207/7  [0207/7]
R47  1K  R-EU_0207/7  [0207/7]
R48  1K  R-EU_0207/7  [0207/7]
R49  1K  R-EU_0207/7  [0207/7]
R50  1K  R-EU_0207/7  [0207/7]
SLIDESWITCH7  CL-SB-22A-01  [CL-SB-22A-01]
SLIDESWITCH9  CL-SB-22A-01  [CL-SB-22A-01]
SLIDESWITCH10  CL-SB-22A-01  [CL-SB-22A-01]
SLIDESWITCH11  CL-SB-22A-01  [CL-SB-22A-01]
X2  MPT2  [2POL254]
X3  MPT2  [2POL254]
X4  MPT2  [2POL254]
X5  MPT2  [2POL254]
X9  MPT2  [2POL254]
X10  MPT2  [2POL254]
X11  MPT2  [2POL254]
X12  MPT2  [2POL254]

### Nets
ENV1_N: C78.1 D6.A R44.2 X12.2 ; also sheet 6
ENV1_P [differential]: C77.1 D5.C R43.2 X12.1 ; also sheet 6
ENV2_N: C80.1 D8.A R46.2 X11.2 ; also sheet 6
ENV2_P [differential]: C79.1 D7.C R45.2 X11.1 ; also sheet 6
ENV3_N: C82.1 D10.A R48.2 X9.2
ENV3_P [differential]: C81.1 D9.C R47.2 X9.1
ENV4_N: C84.1 D12.A R50.2 X10.2
ENV4_P [differential]: C83.1 D11.C R49.2 X10.1
GND [power]: C77.2 C78.2 C79.2 C80.2 C81.2 C82.2 C83.2 C84.2 R43.1 R44.1 R45.1 R46.1 R47.1 R48.1 R49.1 R50.1 ; also sheet 1,2,3,4,6
VO1_3: SLIDESWITCH7.P$3 SLIDESWITCH7.P$6 ; also sheet 4
VO1_3_N: D6.C SLIDESWITCH7.P$5 X2.2
VO1_3_P [differential]: D5.A SLIDESWITCH7.P$2 X2.1
VO2_3: SLIDESWITCH9.P$3 SLIDESWITCH9.P$6 ; also sheet 4
VO2_3_N: D8.C SLIDESWITCH9.P$5 X3.2
VO2_3_P [differential]: D7.A SLIDESWITCH9.P$2 X3.1
VO3_3: SLIDESWITCH11.P$3 SLIDESWITCH11.P$6 ; also sheet 4
VO3_3_N: D10.C SLIDESWITCH11.P$5 X4.2
VO3_3_P [differential]: D9.A SLIDESWITCH11.P$2 X4.1
VO4_3: SLIDESWITCH10.P$3 SLIDESWITCH10.P$6 ; also sheet 4
VO4_3_N: D12.C SLIDESWITCH10.P$5 X5.2
VO4_3_P [differential]: D11.A SLIDESWITCH10.P$2 X5.1
Unconnected: SLIDESWITCH7.P$1 SLIDESWITCH7.P$4 SLIDESWITCH9.P$1 SLIDESWITCH9.P$4 SLIDESWITCH10.P$1 SLIDESWITCH10.P$4 SLIDESWITCH11.P$1 SLIDESWITCH11.P$4

## Sheet 6 of 6
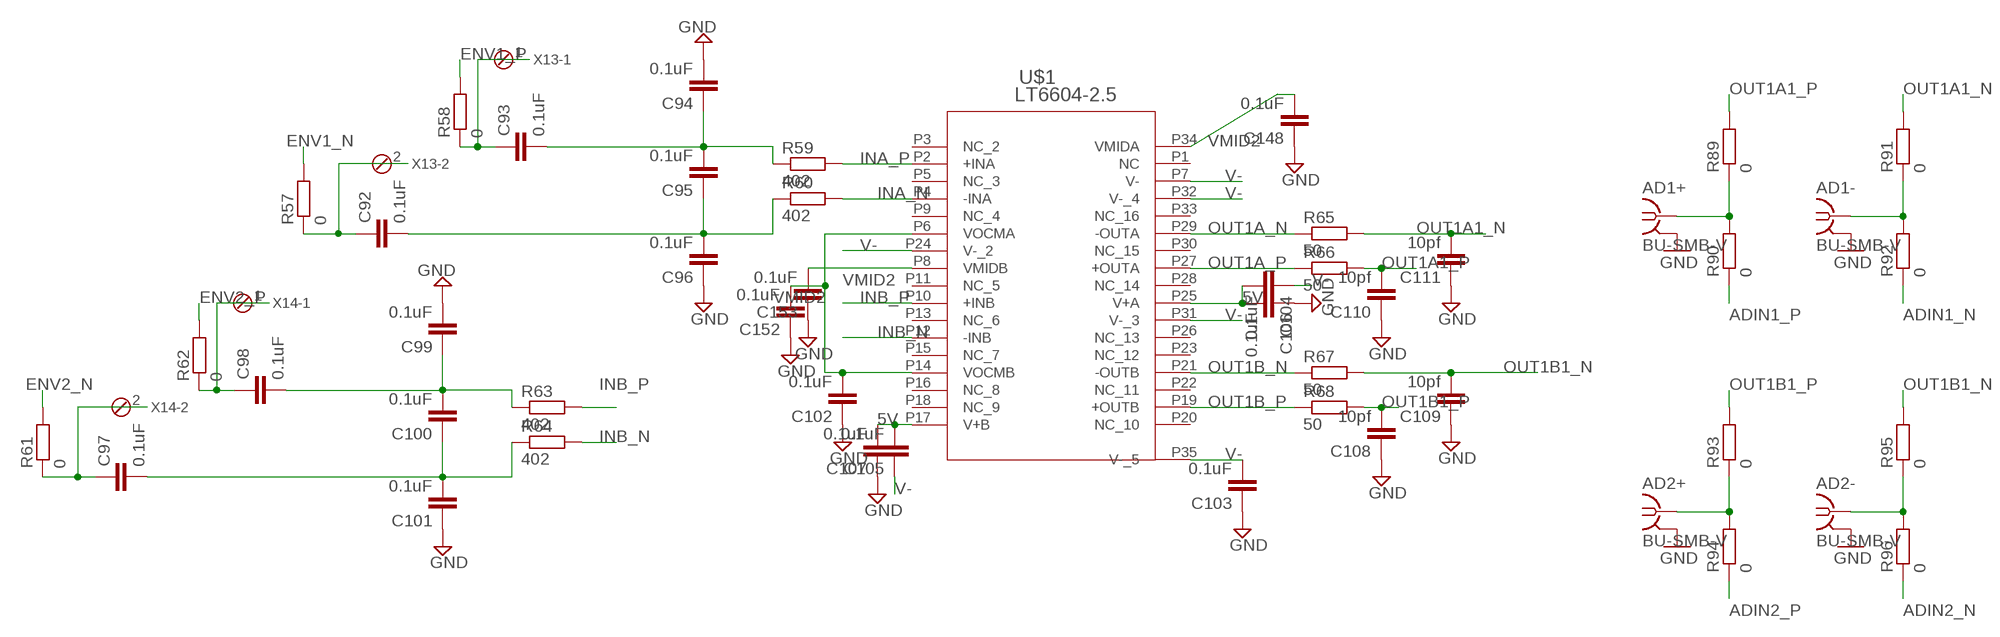
[diagram p5: schematic, sheet 6]

### Parts
AD1+  BU-SMB-V  [BU-SMB-V]
AD1-  BU-SMB-V  [BU-SMB-V]
AD2+  BU-SMB-V  [BU-SMB-V]
AD2-  BU-SMB-V  [BU-SMB-V]
C92  0.1uF  C-EUC0402  [C0402]
C93  0.1uF  C-EUC0402  [C0402]
C94  0.1uF  C-EUC0402  [C0402]
C95  0.1uF  C-EUC0402  [C0402]
C96  0.1uF  C-EUC0402  [C0402]
C97  0.1uF  C-EUC0402  [C0402]
C98  0.1uF  C-EUC0402  [C0402]
C99  0.1uF  C-EUC0402  [C0402]
C100  0.1uF  C-EUC0402  [C0402]
C101  0.1uF  C-EUC0402  [C0402]
C102  0.1uF  C-EUC0402  [C0402]
C103  0.1uF  C-EUC0402  [C0402]
C104  0.1uF  C-EUC0402  [C0402]
C105  0.1uF  C-EUC0402  [C0402]
C106  0.1uF  C-EUC0402  [C0402]
C107  0.1uF  C-EUC0402  [C0402]
C108  10pf  C-EUC0402  [C0402]
C109  10pf  C-EUC0402  [C0402]
C110  10pf  C-EUC0402  [C0402]
C111  10pf  C-EUC0402  [C0402]
C148  0.1uF  C-EUC0402  [C0402]
C152  0.1uF  C-EUC0402  [C0402]
C153  0.1uF  C-EUC0402  [C0402]
R57  0  R-EU_R0402  [R0402]
R58  0  R-EU_R0402  [R0402]
R59  402  R-EU_R0805  [R0805]
R60  402  R-EU_R0805  [R0805]
R61  0  R-EU_R0402  [R0402]
R62  0  R-EU_R0402  [R0402]
R63  402  R-EU_R0805  [R0805]
R64  402  R-EU_R0805  [R0805]
R65  50  R-EU_R0402  [R0402]
R66  50  R-EU_R0402  [R0402]
R67  50  R-EU_R0402  [R0402]
R68  50  R-EU_R0402  [R0402]
R89  0  R-EU_R0402  [R0402]
R90  0  R-EU_R0402  [R0402]
R91  0  R-EU_R0402  [R0402]
R92  0  R-EU_R0402  [R0402]
R93  0  R-EU_R0402  [R0402]
R94  0  R-EU_R0402  [R0402]
R95  0  R-EU_R0402  [R0402]
R96  0  R-EU_R0402  [R0402]
U$1  LT6604-2.5  [QFN50P750X450X80-35T563X147]
X13  MPT2  [2POL254]
X14  MPT2  [2POL254]

### Nets
5V [power]: C104.2 C105.2 C106.2 C107.2 U$1.P17(V+B) U$1.P25(V+A) ; also sheet 1,2,3,4
ADIN1_N: R92.1
ADIN1_P: R90.1
ADIN2_N: R96.1
ADIN2_P: R94.1
ENV1_N: R57.2 ; also sheet 5
ENV1_P [differential]: R58.2 ; also sheet 5
ENV2_N: R61.2 ; also sheet 5
ENV2_P [differential]: R62.2 ; also sheet 5
GND [power]: AD1+.2 AD1+.3 AD1+.4 AD1+.5 AD1-.2 AD1-.3 AD1-.4 AD1-.5 AD2+.2 AD2+.3 AD2+.4 AD2+.5 AD2-.2 AD2-.3 AD2-.4 AD2-.5 C94.2 C96.1 C99.2 C101.1 C102.1 C103.1 C106.1 C107.1 C108.1 C109.1 C110.1 C111.1 C148.1 C152.1 C153.1 ; also sheet 1,2,3,4,5
INA_N [differential]: R60.2 U$1.P4(-INA)
INA_P [differential]: R59.2 U$1.P2(+INA)
INB_N [differential]: R64.2 U$1.P12(-INB)
INB_P [differential]: R63.2 U$1.P10(+INB)
N$3: C97.1 R61.1 X14.2
N$4: C97.2 C100.1 C101.2 R64.1
N$15: C92.1 R57.1 X13.2
N$16: C92.2 C95.1 C96.2 R60.1
N$31: C93.2 C94.1 C95.2 R59.1
N$32: C98.2 C99.1 C100.2 R63.1
N$35: C93.1 R58.1 X13.1
N$36: C98.1 R62.1 X14.1
N$65: AD1+.1 R89.1 R90.2
N$66: AD1-.1 R91.1 R92.2
N$67: AD2+.1 R93.1 R94.2
N$68: AD2-.1 R95.1 R96.2
OUT1A1_N [differential]: C111.2 R65.2 R91.2
OUT1A1_P [differential]: C110.2 R66.2 R89.2
OUT1A_N [differential]: R65.1 U$1.P29(-OUTA)
OUT1A_P [differential]: R66.1 U$1.P27(+OUTA)
OUT1B1_N [differential]: C109.2 R67.2 R95.2
OUT1B1_P [differential]: C108.2 R68.2 R93.2
OUT1B_N [differential]: R67.1 U$1.P21(-OUTB)
OUT1B_P [differential]: R68.1 U$1.P19(+OUTB)
V-: C103.2 C104.1 C105.1 U$1.P7(V-) U$1.P24(V-_2) U$1.P31(V-_3) U$1.P32(V-_4) U$1.P35(V-_5)
VMID2: C102.2 C148.2 C152.2 C153.2 U$1.P6(VOCMA) U$1.P8(VMIDB) U$1.P14(VOCMB) U$1.P34(VMIDA)
Unconnected: U$1.P1(NC) U$1.P3(NC_2) U$1.P5(NC_3) U$1.P9(NC_4) U$1.P11(NC_5) U$1.P13(NC_6) U$1.P15(NC_7) U$1.P16(NC_8) U$1.P18(NC_9) U$1.P20(NC_10) U$1.P22(NC_11) U$1.P23(NC_12) U$1.P26(NC_13) U$1.P28(NC_14) U$1.P30(NC_15) U$1.P33(NC_16)

## Library data of the parts
AD1+ AD1- AD2+ AD2- VO1-VO4 = con-coax:BU-SMB-V: FEMALE SMB CONNECTOR Radiall distributor RS 112-2993; OC_FARNELL: unknown; OC_NEWARK: unknown
C1-C8 C10-C13 C15 C16 C18-C25 C27-C30 C32-C35 C37 C38 C40-C47 C49-C60 C62-C69 C71-C76 C85-C90 = Wurth_Elektronik_Passive_Capacitors_rev18b:WCAP-CSGP_0402: WCAP-CSGP Ceramic Capacitors Characteristics Multilayer Ceramic Chip Capacitor Recommended soldering:Reflow, for 0603 and 0805 wave soldering is also allowed Operating temperature:-55 °C to +125 °C; Ceramic characteristics: Class I - NPO ; Class II -X7R, X5R High performance ceramic High capacitance stability Minimal aging Termination:Cu/Ni/Sn <http://katalog.we-online.de/media/images/eisos/WCAP-CSGP_pf2.jpg> Details see: http://katalog.we-online.de/en/pbs/WCAP-CSGP-0402? Created: 2015-01-28 2015 (C) Wurth Elektronik
C9 C14 C17 C26 C31 C36 C39 C48 C61 C70 C77-C84 C92-C111 C148 C152-C169 = rcl:C-EU: CAPACITOR, European symbol; SPICEPREFIX: C
D1-D4 = BAT64-04E6433:BAT64-04E6433: Infineon BAT64-04E6433, Dual SMT Schottky Fast Recovery Diode, Series, 40V 250mA, 5ns, 3-Pin SOT-23 Source: Datasheet <https://www.infineon.com/dgdl/Infineon-BAT64SERIES-DS-v01_01-en.pdf?fileId=db3a304314dca3890115191757980ead>; DESCRIPTION: Infineon BAT64-04E6433, Dual SMT Schottky Fast Recovery Diode, Series, 40V 250mA, 5ns, 3-Pin SOT-23; HEIGHT: 1.1mm; MANUFACTURER_NAME: Infineon; MANUFACTURER_PART_NUMBER: BAT64-04E6433
D5-D12 = dfls130l-7:SBR3U20SA: Super Barrier Rectifier Diode; MF: Diodes Inc; MOUSER: SBR3U20SA; MPN: SBR3U20SA
IC1-IC3 = AD8334ACPZ:AD8334ACPZ: AD8334ACPZ, Programmable Gain Amplifier 4, 64-Pin LFCSP VQ Source: Datasheet <http://docs-emea.rs-online.com/webdocs/12fa/0900766b812fac01.pdf>; DESCRIPTION: AD8334ACPZ, Programmable Gain Amplifier 4, 64-Pin LFCSP VQ; HEIGHT: 1mm; MANUFACTURER_NAME: Analog Devices; MANUFACTURER_PART_NUMBER: AD8334ACPZ; MOUSER_PART_NUMBER: 584-AD8334ACPZ; MOUSER_PRICE-STOCK: https://www.mouser.com/Search/Refine.aspx?Keyword=584-AD8334ACPZ; RS_PART_NUMBER: 8099263P; RS_PRICE-STOCK: http://uk.rs-online.com/web/p/products/8099263P
IN1-IN4 = con-coax:BU-SMB-H: FEMALE SMB CONNECTOR Radiall distributor RS 112-3003; OC_FARNELL: unknown; OC_NEWARK: unknown
JP1-JP6 = jumper:JP1E: JUMPER
L2-L5 L7 L8 L27-L32 L41-L46 = resistor:L-EU: INDUCTOR, European symbol
L17 L18 L25 L26 = rcl:L-EU: INDUCTOR, European symbol; SPICEPREFIX: L
L33-L40 = OPL_Ferrite_and_Magnetic_Bead:SMD-FERRITE-CHIP-120-OHM-500MA(0603): 303030001; MPN: BLM18AG121SN1D; VALUE: 120OHM-500MA
R1 R10-R15 R24-R42 R51-R56 = resistor:R-EU_: RESISTOR, European symbol
R43-R50 R57-R68 R89-R96 RCONN1_1-RCONN1_8 = rcl:R-EU_: RESISTOR, European symbol; SPICEPREFIX: R
SLIDESWITCH1-SLIDESWITCH6 = wouter:CL-SB-12A-01
SLIDESWITCH7 SLIDESWITCH9-SLIDESWITCH11 = wouter:CL-SB-22A-01
T1-T4 = T1-6T-KK81:T1-6T-KK81: Surface Mount RF Transofrmer Source: Datasheet <https://ww3.minicircuits.com/pdfs/T1-6T-KK81.pdf>; DESCRIPTION: Surface Mount RF Transofrmer; HEIGHT: 6.6mm; MANUFACTURER_NAME: Mini-Circuits; MANUFACTURER_PART_NUMBER: T1-6T-KK81
TP1_1-TP1_4 TP2_1-TP2_4 TP2_GND TP_GND = 5019:5019: Test Point, Compact, Surface Mount; AVAILABILITY: Good; DESCRIPTION: Phosphor Bronze Contact Miniature Silver Plated Surface Mount Test Points; MF: Keystone; MP: 5019; PACKAGE: 2010 Keystone; PRICE: 0.18 USD
U$1 = wouter:LT6604-2.5
U$3-U$8 = wouter:BOURNSPVG3A
X1-X14 = con-phoenix-254:MPT2: PHOENIX CONNECTOR; OC_FARNELL: unknown; OC_NEWARK: unknown